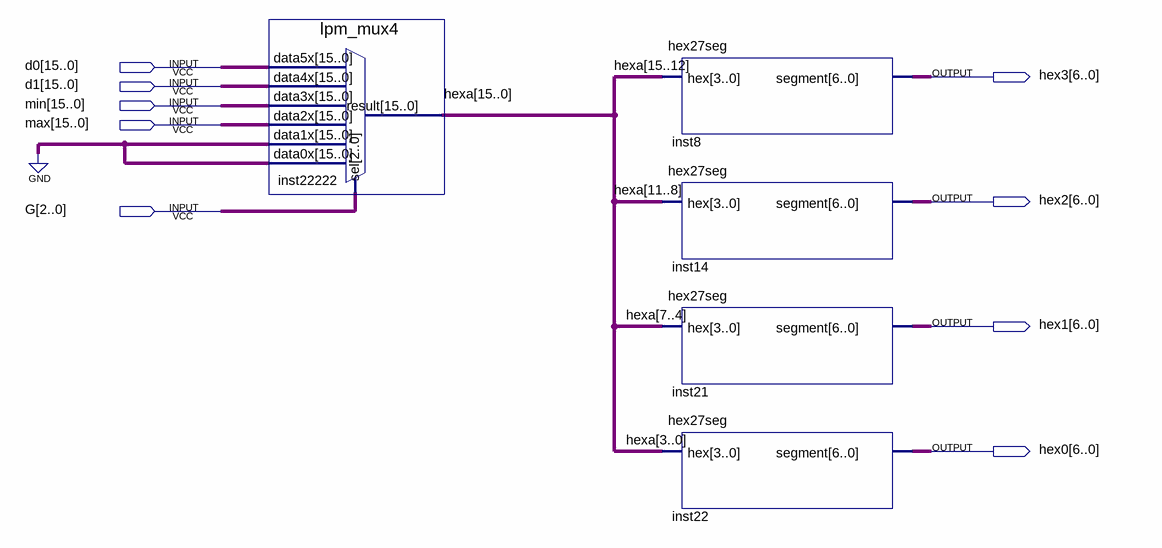
[diagram p0: schematic sheet]
// Quartus schematic display_select_control.bdf as structural Verilog: 5 symbols, 9 pins
module display_select_control (
  input  [15:0] d0,
  input  [15:0] d1,
  input  [15:0] min,
  input  [15:0] max,
  input  [2:0] G,
  output [6:0] hex3,
  output [6:0] hex2,
  output [6:0] hex1,
  output [6:0] hex0
);

  wire [15:0] hexa;

  lpm_mux4 inst22222 (
    .data5x(d0), .data4x(d1), .data3x(min), .data2x(max), .data1x({16{1'b0}}), .data0x({16{1'b0}}), .sel(G),
    .result(hexa));
  hex27seg inst8 (.hex(hexa[15:12]), .segment(hex3));
  hex27seg inst14 (.hex(hexa[11:8]), .segment(hex2));
  hex27seg inst21 (.hex(hexa[7:4]), .segment(hex1));
  hex27seg inst22 (.hex(hexa[3:0]), .segment(hex0));
endmodule
